# EAGLE design heater_v1 (EAGLE 7.2.0)
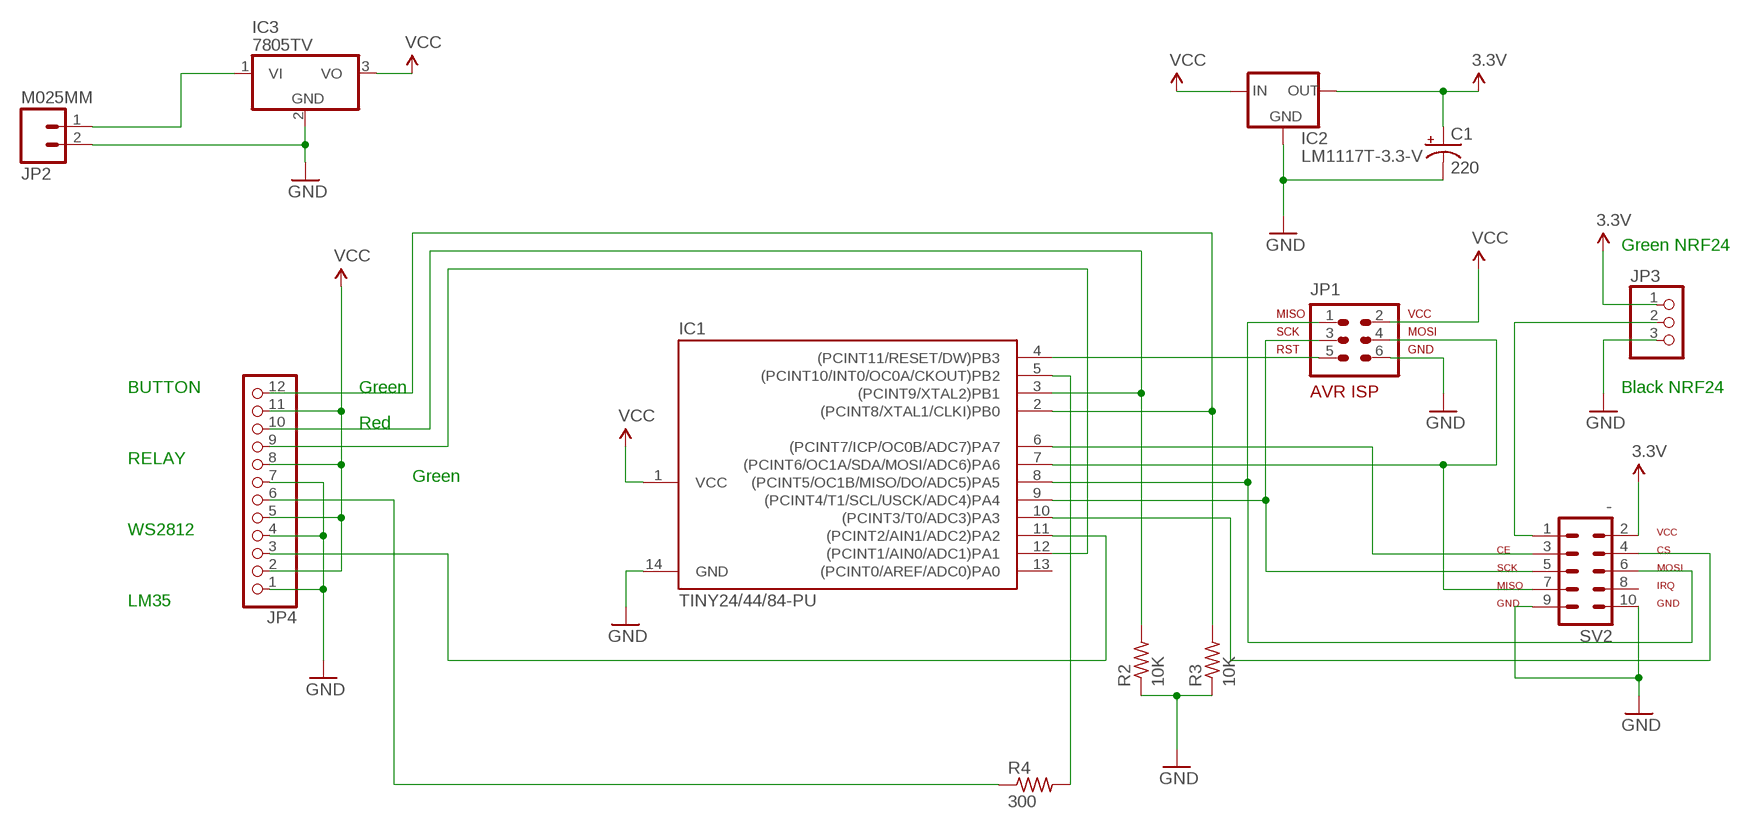
[diagram p0: schematic, sheet 1]

## Parts
C1  220  CPOL-USE2.5-6  [E2,5-6]
IC1  TINY24/44/84-PU  [DIL14]
IC2  LM1117T-3.3-V  [TO220V]
IC3  7805TV  [TO220V]
JP1  AVR-ISP-6VERT  [AVR-ISP-6]
JP2  M025MM  [SCREWTERMINAL-5MM-2]
JP3  PINHD-1X3  [1X03]
JP4  PINHD-1X12-CB  [1X12-CB]
R2  10K  R-US_0204/7  [0204/7]
R3  10K  R-US_0204/7  [0204/7]
R4  300  R-US_0204/7  [0204/7]
SV2  -  MA05-2  [MA05-2]

## Nets
3.3V: C1.+ IC2.2(OUT) JP3.1 SV2.2
GND: C1.- IC1.14(GND) IC2.1(GND) IC3.2(GND) JP1.6 JP2.2 JP3.3 JP4.1 JP4.4 JP4.7 R2.1 R3.1 SV2.9 SV2.10
N$1: IC1.5((PCINT10/INT0/OC0A/CKOUT)PB2) R4.2
N$2: IC1.4((PCINT11/RESET/DW)PB3) JP1.5
N$3: IC1.7((PCINT6/OC1A/SDA/MOSI/ADC6)PA6) JP1.4 SV2.7
N$4: IC1.8((PCINT5/OC1B/MISO/DO/ADC5)PA5) JP1.1 SV2.6
N$5: IC1.9((PCINT4/T1/SCL/USCK/ADC4)PA4) JP1.3 SV2.5
N$6: IC1.10((PCINT3/T0/ADC3)PA3) SV2.4
N$7: IC1.6((PCINT7/ICP/OC0B/ADC7)PA7) SV2.3
N$8: IC1.2((PCINT8/XTAL1/CLKI)PB0) JP4.12 R3.2
N$9: IC1.3((PCINT9/XTAL2)PB1) JP4.10 R2.2
N$10: IC1.12((PCINT1/AIN0/ADC1)PA1) JP4.9
N$11: IC1.11((PCINT2/AIN1/ADC2)PA2) JP4.3
N$12: IC3.1(VI) JP2.1
N$13: JP4.6 R4.1
N$14: JP3.2 SV2.1
VCC: IC1.1(VCC) IC2.3(IN) IC3.3(VO) JP1.2 JP4.2 JP4.5 JP4.8 JP4.11
Unconnected: IC1.13((PCINT0/AREF/ADC0)PA0) SV2.8

## Notes on the sheet
- Green NRF24
- BUTTON | Green | Black NRF24
- Red
- RELAY
- Green
- WS2812 | VCC
- CE | CS
- SCK | MOSI
- MISO | IRQ
- LM35 | GND | GND

## Library data of the parts
C1 = adafruit:CPOL-US: POLARIZED CAPACITOR, American symbol
IC1 = avr-7:TINY24/44/84
IC2 = lm1117:LM1117T-*
IC3 = linear:78*: Positive VOLTAGE REGULATOR Source: http://cache.national.com/ds/LM/LM78L05.pdf http://www.fairchildsemi.com/ds/LM/LM7805.pdf
JP1 = avr-7:AVR-ISP-6: AVR ISP-6 Serial Programming Header
JP2 = SparkFun-Connectors:M02: Standard 2-pin 0.1" header. Use with - straight break away headers ( PRT-00116) - right angle break away headers (PRT-00553) - swiss pins (PRT-00743) - machine pins (PRT-00117) - female headers (PRT-00115) Molex polarized connector foot print use with: PRT-08233 with associated crimp pins and housings. 2.54_SCREWTERM for use with PRT-10571. 3.5mm Screw Terminal footprints for PRT-08084 5mm Screw Terminal footprints for use with PRT-08432; STOREFRONT_ID: PRT-08432
JP3 = adafruit:PINHD-1X3: PIN HEADER
JP4 = adafruit:PINHD-1X12: PIN HEADER
R2-R4 = adafruit:R-US_: RESISTOR, American symbol
SV2 = con-lstb:MA05-2: PIN HEADER; OC_FARNELL: unknown; OC_NEWARK: unknown

## Board
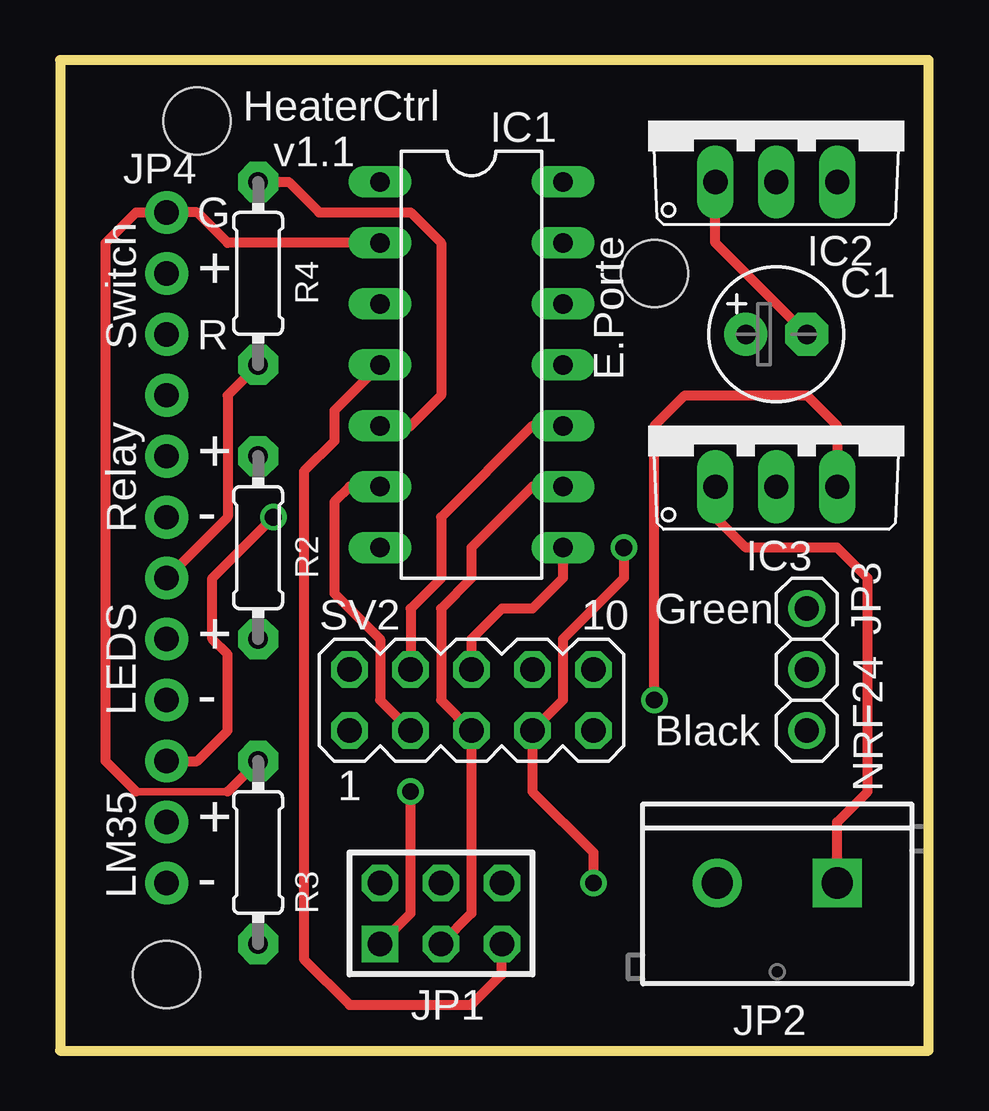
[diagram p1: board, top side]
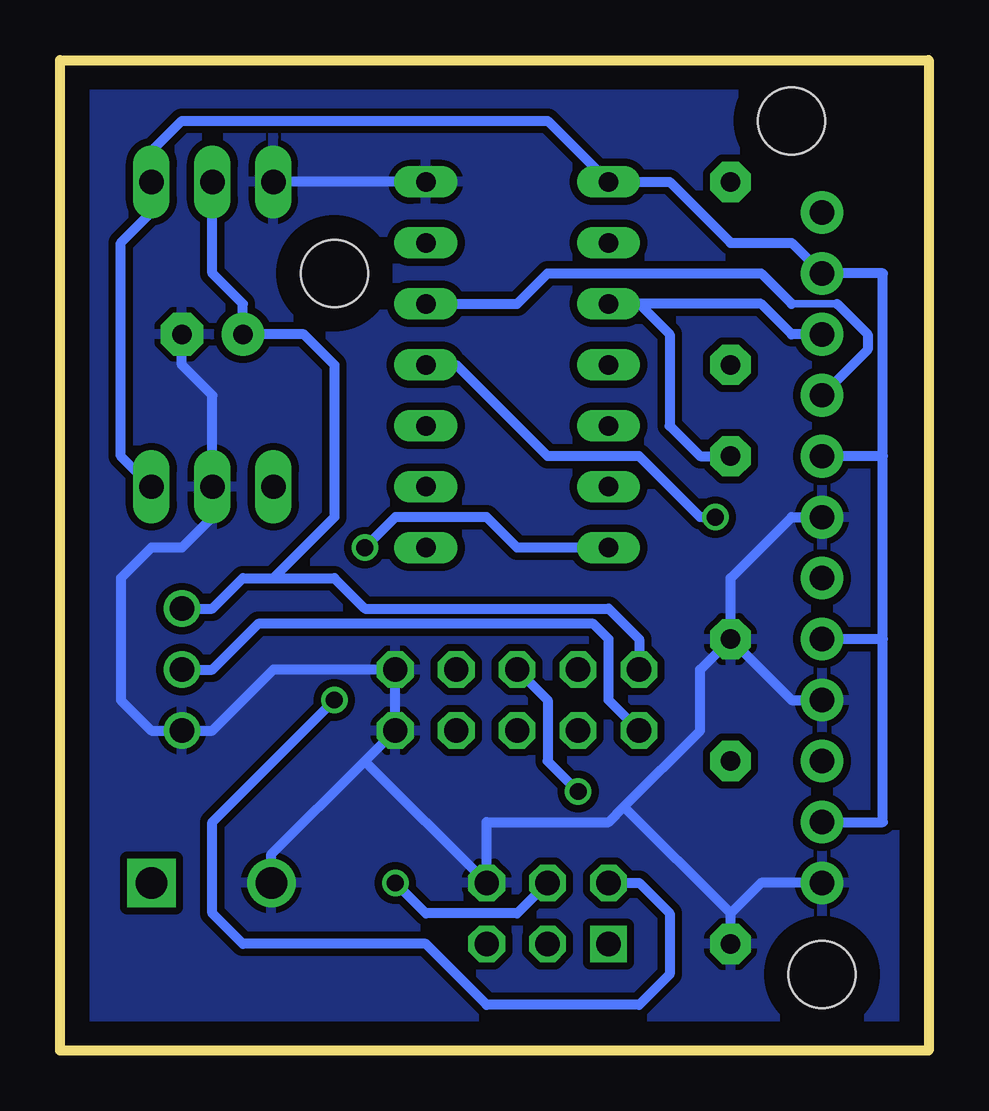
[diagram p2: board, bottom side, seen from below]

Size 36.2 x 41.27 mm. Coordinates in mm from the lower left corner, seen from the top.
Outline: 0,41.27 0,0 36.2,0 36.2,41.27 0,41.27
Copper layers (1*16): Top 0.035mm / dielectric 1.5mm / Bottom 0.035mm
Design rules "default": minimum track width 10mil, minimum drill 24mil, track to track 8mil, track to pad 8mil, pad to pad 8mil, via to via 8mil, smd to smd 8mil, copper to edge 40mil, drill to drill 8mil, minimum pad ring 10mil, minimum via ring 8mil, stop-mask expansion 4mil, vias tented up to drill 0mil, thermal gap 10mil
Holes 2.8 mm at 24.77,32.38 5.71,38.73 4.45,3.18

### Footprints (pad centres in the part's own frame; a part is rotated, then mirrored left to right if it is on the bottom)
E2,5-6 = drill 0.813 pad 1.778: + -1.27,0 | drill 0.813 pad 1.778 octagon: - 1.27,0
DIL14 = drill 0.813 long: 1 -7.62,-3.81; 2 -5.08,-3.81; 3 -2.54,-3.81; 4 0,-3.81; 5 2.54,-3.81; 6 5.08,-3.81; 7 7.62,-3.81; 8 7.62,3.81; 9 5.08,3.81; 10 2.54,3.81; 11 0,3.81; 12 -2.54,3.81; 13 -5.08,3.81; 14 -7.62,3.81
TO220V = drill 1.016 long: 1 -2.54,-2.54; 2 0,-2.54; 3 2.54,-2.54
AVR-ISP-6 = drill 1.016 square: 1 -2.54,-1.27 | drill 1.016 octagon: 2 -2.54,1.27; 3 0,-1.27; 4 0,1.27; 5 2.54,-1.27; 6 2.54,1.27
SCREWTERMINAL-5MM-2 = drill 1.3 pad 2.032 square: 1 0,0 | drill 1.3 pad 2.032: 2 5,0
1X03 = drill 1.016: 1 -2.54,0; 2 0,0; 3 2.54,0
1X12-CB = drill 1.016 pad 1.778: 1 -13.97,0; 2 -11.43,0; 3 -8.89,0; 4 -6.35,0; 5 -3.81,0; 6 -1.27,0; 7 1.27,0; 8 3.81,0; 9 6.35,0; 10 8.89,0; 11 11.43,0; 12 13.97,0
0204/7 = drill 0.813 pad 1.676 octagon: 1 -3.81,0; 2 3.81,0
MA05-2 = drill 1.016 octagon: 1 -5.08,-1.27; 2 -5.08,1.27; 3 -2.54,-1.27; 4 -2.54,1.27; 5 0,-1.27; 6 0,1.27; 7 2.54,-1.27; 8 2.54,1.27; 9 5.08,-1.27; 10 5.08,1.27

### Placement (x,y rotation side)
C1  29.85,29.84 0 top
IC1  17.14,28.57 270 top
IC2  29.85,38.73 0 top
IC3  29.85,26.03 0 top
JP1  15.88,5.71 0 top
JP2  32.39,6.98 180 top
JP3  31.11,15.88 270 top
JP4  4.45,20.95 90 top
R2  8.25,20.95 90 top
R3  8.25,8.25 90 top
R4  8.25,32.38 90 top
SV2  17.14,14.61 0 top

### Tracks (layer width: path | path; a pad name or v marks a point on that pad's centre or on a via)
3.3V
  Bottom 0.406: SV2.2 12.07,17.14 13.34,18.41 23.5,18.41 24.77,19.69 27.31,19.69 | IC2.2 29.85,32.38 28.57,31.12 C1.+ 26.04,29.84 24.77,28.57 24.77,22.23 27.31,19.69 | JP3.1 29.85,18.41 28.57,19.69 27.31,19.69
GND
  Top 0.406: C1.- 27.31,33.66 IC2.1
  Bottom 0.406: JP2.2 27.39,8.18 23.5,12.06 | 23.5,12.06 SV2.9 SV2.10 27.31,15.88 29.85,13.34 JP3.3 32.39,13.34 33.66,14.61 33.66,19.69 32.39,20.95 31.11,20.95 29.85,22.23 IC3.2 29.85,27.3 31.11,28.57 C1.- | 23.5,12.06 JP1.6 18.42,9.52 13.34,9.52 12.7,10.16 | R2.1 9.53,15.88 9.53,13.34 12.7,10.16 | R2.1 8.25,19.69 5.71,22.23 JP4.7 | R2.1 5.71,14.61 JP4.4 | R3.1 8.25,5.71 | 8.25,5.71 12.7,10.16 | JP4.1 6.99,6.98 8.25,5.71 | IC1.14 IC2.1
  pour Bottom (isolate 0.305): 0,41.27 0,0 36.2,0 36.2,41.27
N$1
  Top 0.406: R4.2 9.53,36.2 10.79,34.92 14.61,34.92 15.88,33.66 15.88,27.3 14.61,26.03 IC1.5
N$2
  Top 0.406: IC1.4 11.43,26.67 11.43,25.4 10.16,24.13 10.16,3.81 12.07,1.9 17.14,1.9 18.42,3.18 JP1.5
N$3  (via drill 0.7)
  Top 0.406: v23.5,20.95 23.5,19.69 20.96,17.14 20.96,14.61 SV2.7 19.68,10.79 22.23,8.25 v22.23,6.98
  Bottom 0.406: IC1.7 17.14,20.95 18.42,22.23 22.23,22.23 v23.5,20.95 | JP1.4 17.14,5.71 20.96,5.71 v22.23,6.98
N$4  (via drill 0.7)
  Top 0.406: IC1.8 20.96,19.69 19.68,18.41 18.42,18.41 17.14,17.14 SV2.6 | JP1.1 14.61,5.71 v14.61,10.79
  Bottom 0.406: SV2.6 15.88,14.61 15.88,12.06 v14.61,10.79
N$5
  Top 0.406: IC1.9 19.68,23.49 17.14,20.95 17.14,19.69 15.88,18.41 15.88,14.61 SV2.5 17.14,5.71 JP1.3
N$6
  Top 0.406: IC1.10 19.68,26.03 15.88,22.23 15.88,19.69 14.61,18.41 SV2.4
N$7
  Top 0.406: IC1.6 12.07,23.49 11.43,22.86 11.43,19.05 13.34,17.14 13.34,14.61 SV2.3
N$8
  Top 0.305: 3.18,10.79 6.99,10.79
  Top 0.406: 3.18,10.79 1.91,12.06 1.91,33.66 3.18,34.92 JP4.12 5.71,34.92 6.99,33.66 IC1.2 | 6.99,10.79 R3.2
N$9
  Bottom 0.406: JP4.10 5.71,29.84 6.99,31.12 IC1.3 12.07,31.12 10.79,29.84 10.79,26.03 9.53,24.77 R2.2
N$10
  Bottom 0.305: 5.71,31.12 3.81,31.12
  Bottom 0.406: IC1.12 17.14,31.12 15.88,32.38 6.99,32.38 5.71,31.12 | JP4.9 2.54,29.21 2.54,29.84 3.81,31.12
N$11  (via drill 0.7)
  Top 0.406: JP4.3 5.71,12.06 6.99,13.34 6.99,16.51 6.35,17.14 6.35,19.69 v8.89,22.23
  Bottom 0.406: v8.89,22.23 9.53,22.23 12.07,24.77 15.88,24.77 19.68,28.57 IC1.11
N$12
  Top 0.406: JP2.1 32.39,9.52 33.66,10.79 33.66,19.69 32.39,20.95 28.57,20.95 27.31,22.23 IC3.1
N$13
  Top 0.406: R4.1 6.99,27.3 6.99,22.23 JP4.6
N$14
  Bottom 0.406: JP3.2 29.85,15.88 27.94,17.78 13.97,17.78 13.34,17.14 13.34,14.61 SV2.1
VCC  (via drill 0.7)
  Top 0.406: v24.77,14.61 24.77,26.03 26.04,27.3 31.11,27.3 32.39,26.03 IC3.3
  Bottom 0.406: 1.91,24.77 1.91,32.38 JP4.11 5.71,33.66 8.25,33.66 10.79,36.2 IC1.1 15.88,38.73 31.11,38.73 32.39,37.46 IC2.3 32.39,34.92 33.66,33.66 33.66,24.77 IC3.3 | 1.91,24.77 JP4.8 | 1.91,17.14 1.91,24.77 | 1.91,17.14 JP4.5 | 1.91,17.14 1.91,9.52 JP4.2 | JP1.2 12.07,6.98 10.79,5.71 10.79,3.18 12.07,1.9 18.42,1.9 20.96,4.45 28.57,4.45 29.85,5.71 29.85,9.52 v24.77,14.61

### Text on the board
tPlace: HeaterCtrl | v1.1 | G | + | Switch | R | E.Porte | + | Relay | - | Green | + | LEDS | - | Black | NRF24 | + | LM35 | -